# Altium schematic sheet machdien.SchDoc
size A0 portrait; SheetNumber: 1; SheetTotal: 1
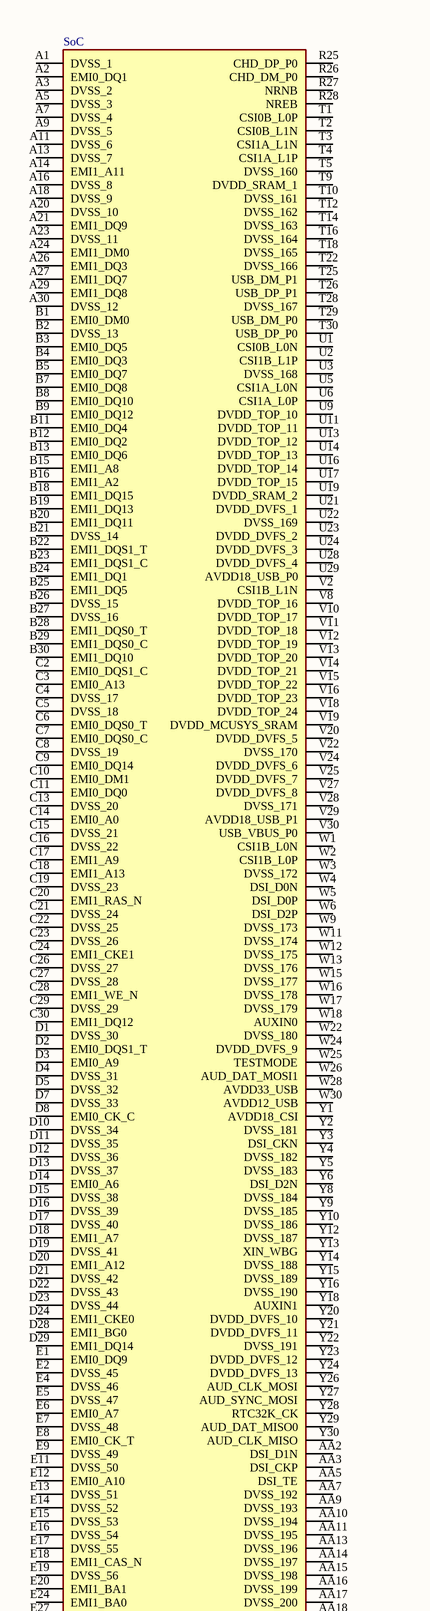
[diagram p0: machdien.SchDoc, top left]
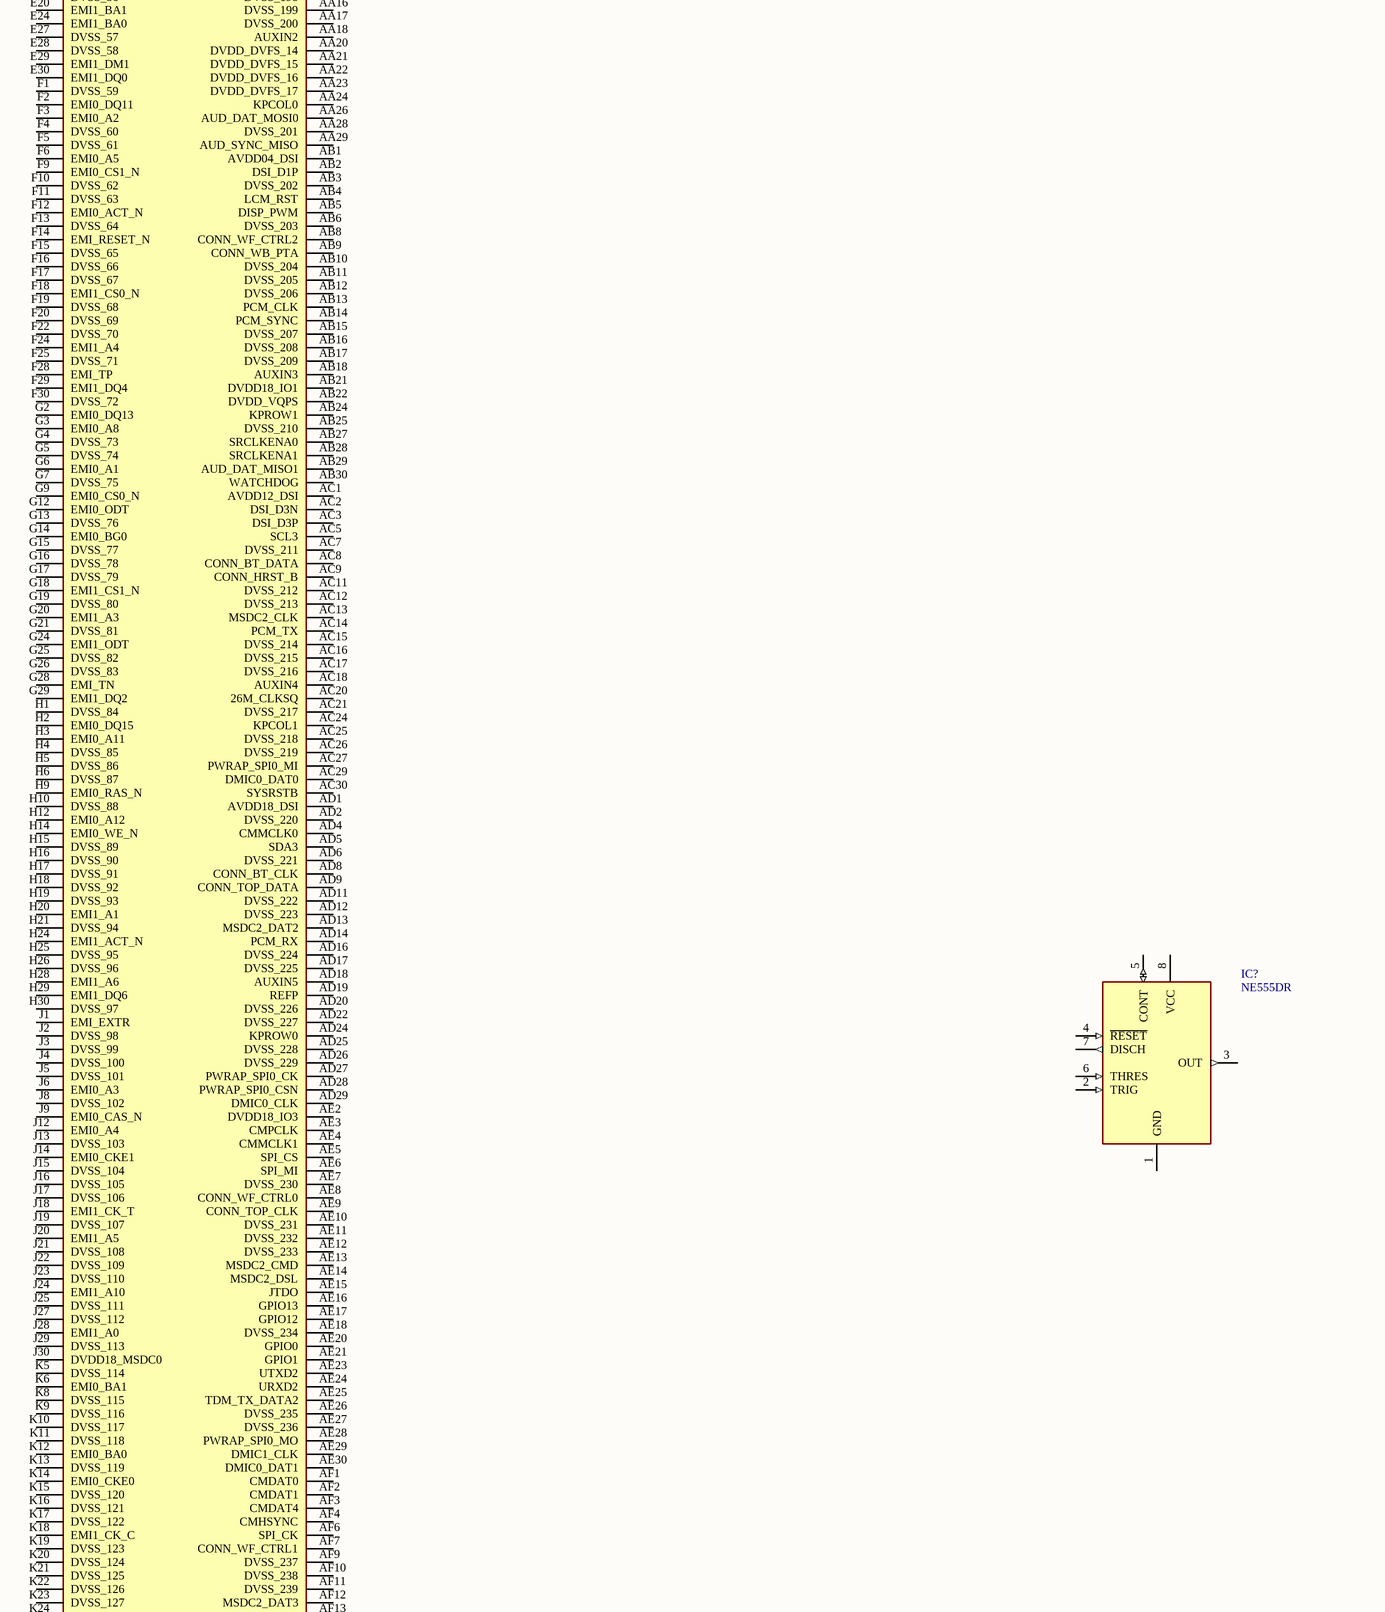
[diagram p1: machdien.SchDoc, centre left]
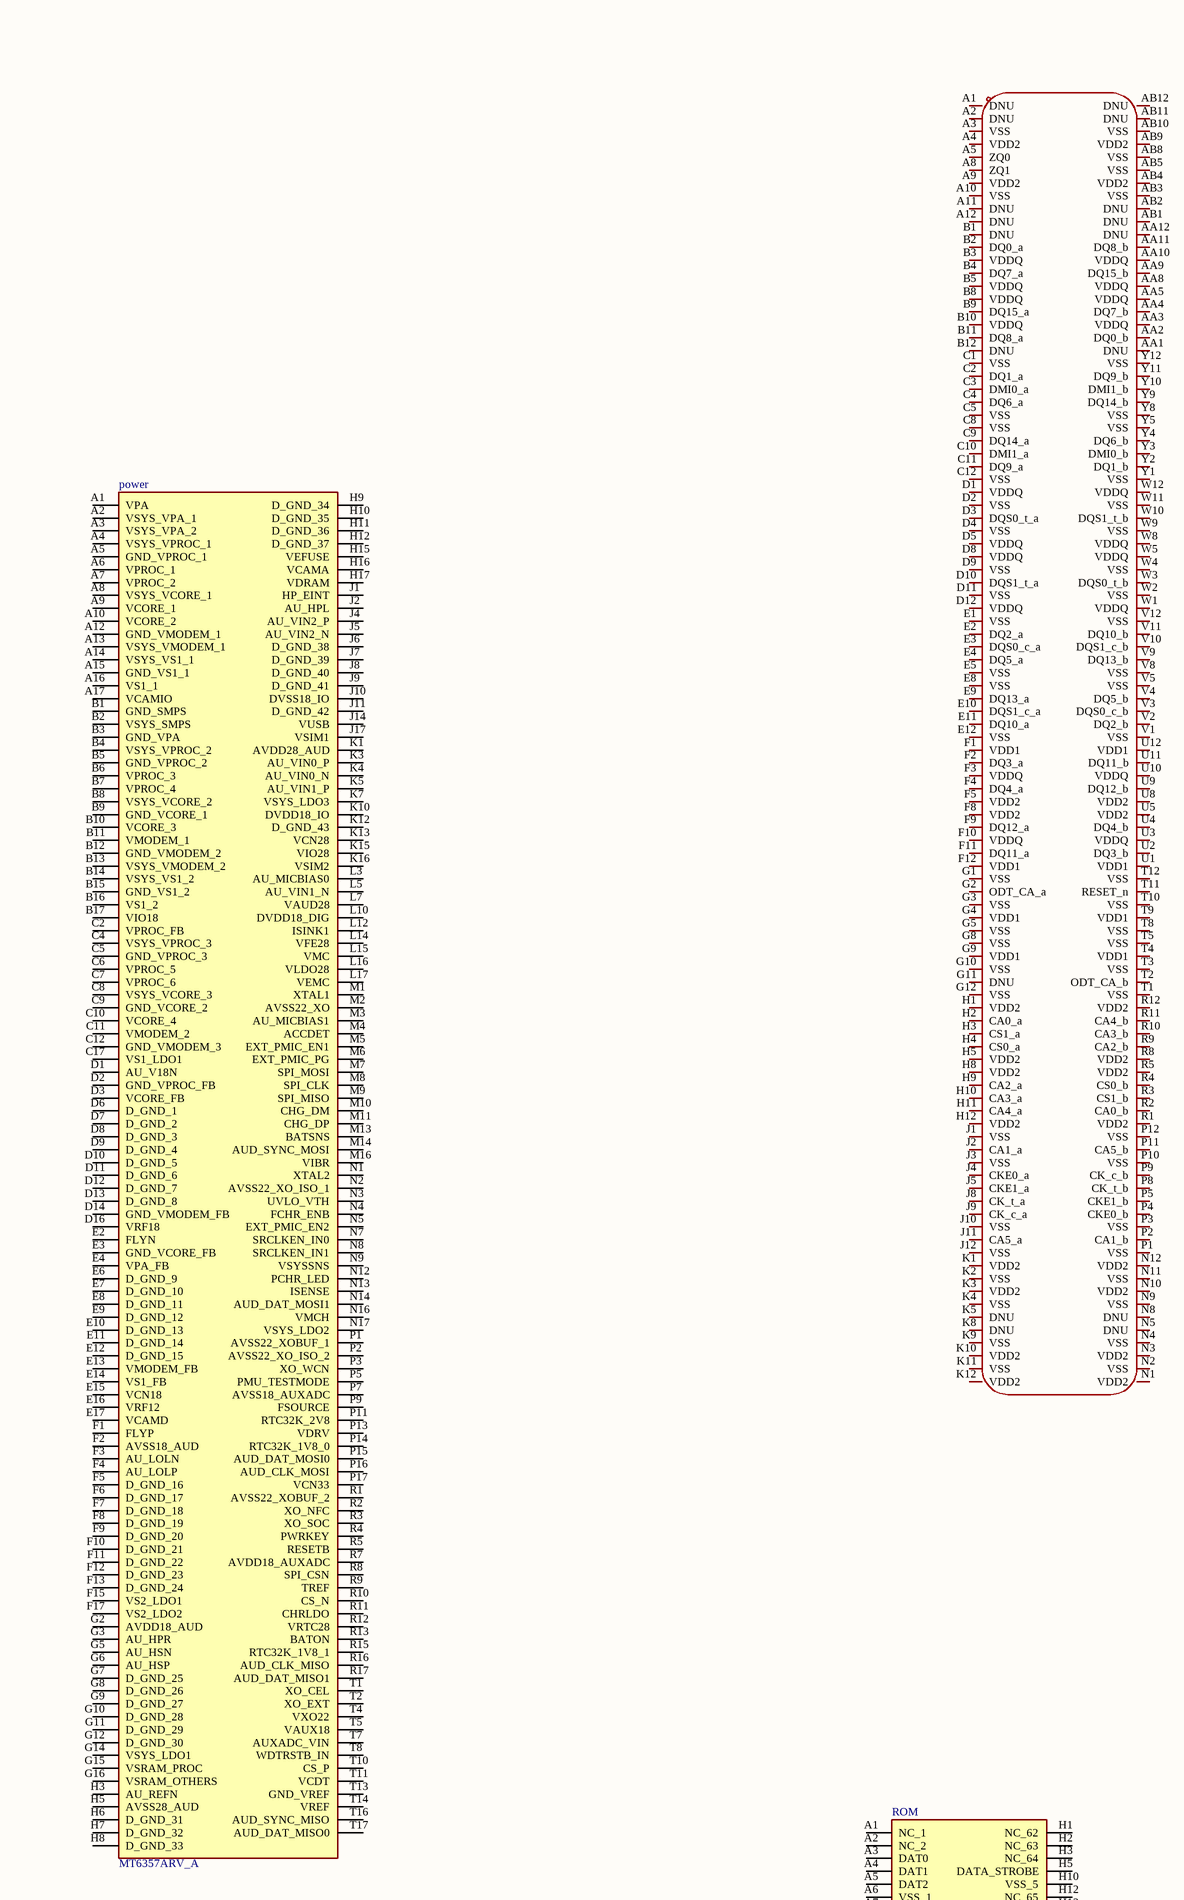
[diagram p2: machdien.SchDoc, centre right]
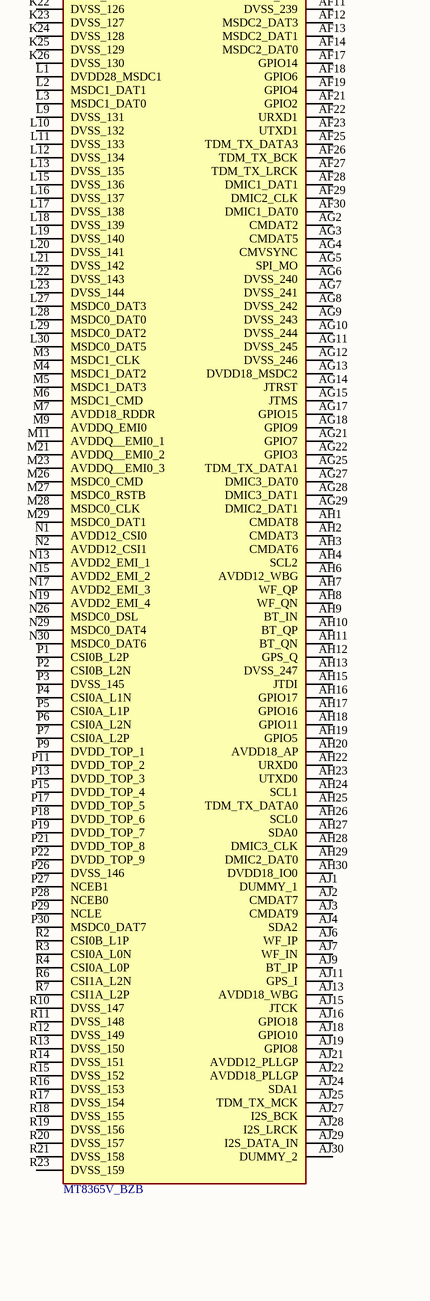
[diagram p3: machdien.SchDoc, bottom left]
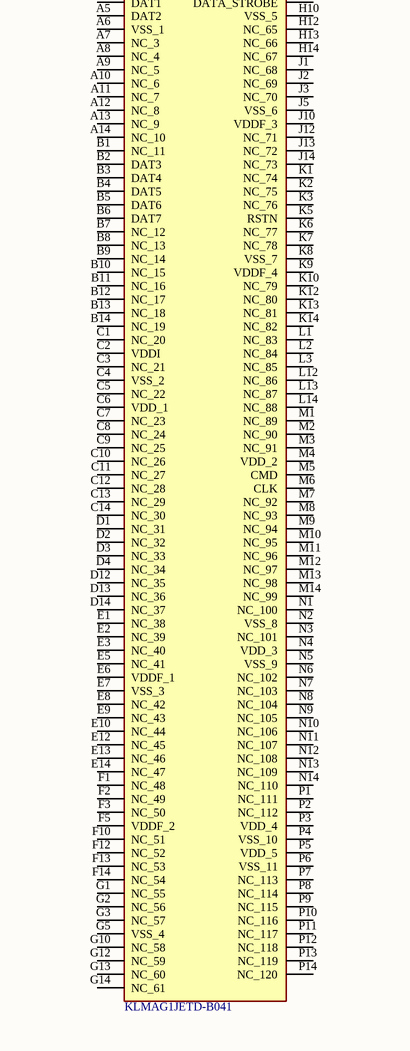
[diagram p4: machdien.SchDoc, bottom right]

## Parts
IC?  NE555DR  [SOIC127P600X175-8N]
power  MT6357ARV_A  [BGA209C40P17X16_700X660X100]
RAM  K4UBE3D4AA-MGCL  [K4F8E304HB-MGCJ]  (value not drawn)
ROM  KLMAG1JETD-B041  [BGA153C50P14X14_1150X1300X80]
SoC  MT8365V_BZB  [BGA633C40P30X29_1220X1180X90]

## Nets

Not connected (* = marked no-connect by the designer): IC? 1(GND) 2(TRIG) 3(OUT) 4(~{RESET}) 5(CONT) 6(THRES) 7(DISCH) 8(VCC); power A1(VPA) A2(VSYS_VPA_1) A3(VSYS_VPA_2) A4(VSYS_VPROC_1) A5(GND_VPROC_1) A6(VPROC_1) A7(VPROC_2) A8(VSYS_VCORE_1) A9(VCORE_1) A10(VCORE_2) A12(GND_VMODEM_1) A13(VSYS_VMODEM_1) A14(VSYS_VS1_1) A15(GND_VS1_1) A16(VS1_1) A17(VCAMIO) B1(GND_SMPS) B2(VSYS_SMPS) B3(GND_VPA) B4(VSYS_VPROC_2) B5(GND_VPROC_2) B6(VPROC_3) B7(VPROC_4) B8(VSYS_VCORE_2) B9(GND_VCORE_1) B10(VCORE_3) B11(VMODEM_1) B12(GND_VMODEM_2) B13(VSYS_VMODEM_2) B14(VSYS_VS1_2) B15(GND_VS1_2) B16(VS1_2) B17(VIO18) C2(VPROC_FB) C4(VSYS_VPROC_3) C5(GND_VPROC_3) C6(VPROC_5) C7(VPROC_6) C8(VSYS_VCORE_3) C9(GND_VCORE_2) C10(VCORE_4) C11(VMODEM_2) C12(GND_VMODEM_3) C17(VS1_LDO1) D1(AU_V18N) D2(GND_VPROC_FB) D3(VCORE_FB) D6(D_GND_1) D7(D_GND_2) D8(D_GND_3) D9(D_GND_4) D10(D_GND_5) D11(D_GND_6) D12(D_GND_7) D13(D_GND_8) D14(GND_VMODEM_FB) D16(VRF18) E2(FLYN) E3(GND_VCORE_FB) E4(VPA_FB) E6(D_GND_9) E7(D_GND_10) E8(D_GND_11) E9(D_GND_12) E10(D_GND_13) E11(D_GND_14) E12(D_GND_15) E13(VMODEM_FB) E14(VS1_FB) E15(VCN18) E16(VRF12) E17(VCAMD) F1(FLYP) F2(AVSS18_AUD) F3(AU_LOLN) F4(AU_LOLP) F5(D_GND_16) F6(D_GND_17) F7(D_GND_18) F8(D_GND_19) F9(D_GND_20) F10(D_GND_21) F11(D_GND_22) F12(D_GND_23) F13(D_GND_24) F15(VS2_LDO1) F17(VS2_LDO2) G2(AVDD18_AUD) G3(AU_HPR) G5(AU_HSN) G6(AU_HSP) G7(D_GND_25) G8(D_GND_26) G9(D_GND_27) G10(D_GND_28) G11(D_GND_29) G12(D_GND_30) G14(VSYS_LDO1) G15(VSRAM_PROC) G16(VSRAM_OTHERS) H3(AU_REFN) H5(AVSS28_AUD) H6(D_GND_31) H7(D_GND_32) H8(D_GND_33) H9(D_GND_34) H10(D_GND_35) H11(D_GND_36) H12(D_GND_37) H15(VEFUSE) H16(VCAMA) H17(VDRAM) J1(HP_EINT) J2(AU_HPL) J4(AU_VIN2_P) J5(AU_VIN2_N) J6(D_GND_38) J7(D_GND_39) J8(D_GND_40) J9(D_GND_41) J10(DVSS18_IO) J11(D_GND_42) J14(VUSB) J17(VSIM1) K1(AVDD28_AUD) K3(AU_VIN0_P) K4(AU_VIN0_N) K5(AU_VIN1_P) K7(VSYS_LDO3) K10(DVDD18_IO) K12(D_GND_43) K13(VCN28) K15(VIO28) K16(VSIM2) L3(AU_MICBIAS0) L5(AU_VIN1_N) L7(VAUD28) L10(DVDD18_DIG) L12(ISINK1) L14(VFE28) L15(VMC) L16(VLDO28) L17(VEMC) M1(XTAL1) M2(AVSS22_XO) M3(AU_MICBIAS1) M4(ACCDET) M5(EXT_PMIC_EN1) M6(EXT_PMIC_PG) M7(SPI_MOSI) M8(SPI_CLK) M9(SPI_MISO) M10(CHG_DM) M11(CHG_DP) M13(BATSNS) M14(AUD_SYNC_MOSI) M16(VIBR) N1(XTAL2) N2(AVSS22_XO_ISO_1) N3(UVLO_VTH) N4(FCHR_ENB) N5(EXT_PMIC_EN2) N7(SRCLKEN_IN0) N8(SRCLKEN_IN1) N9(VSYSSNS) N12(PCHR_LED) N13(ISENSE) N14(AUD_DAT_MOSI1) N16(VMCH) N17(VSYS_LDO2) P1(AVSS22_XOBUF_1) P2(AVSS22_XO_ISO_2) P3(XO_WCN) P5(PMU_TESTMODE) P7(AVSS18_AUXADC) P9(FSOURCE) P11(RTC32K_2V8) P13(VDRV) P14(RTC32K_1V8_0) P15(AUD_DAT_MOSI0) P16(AUD_CLK_MOSI) P17(VCN33) R1(AVSS22_XOBUF_2) R2(XO_NFC) R3(XO_SOC) R4(PWRKEY) R5(RESETB) R7(AVDD18_AUXADC) R8(SPI_CSN) R9(TREF) R10(CS_N) R11(CHRLDO) R12(VRTC28) R13(BATON) R15(RTC32K_1V8_1) R16(AUD_CLK_MISO) R17(AUD_DAT_MISO1) T1(XO_CEL) T2(XO_EXT) T4(VXO22) T5(VAUX18) T7(AUXADC_VIN) T8(WDTRSTB_IN) T10(CS_P) T11(VCDT) T13(GND_VREF) T14(VREF) T16(AUD_SYNC_MISO) T17(AUD_DAT_MISO0); RAM A1(DNU) A2(DNU) A3(VSS) A4(VDD2) A5(ZQ0) A8(ZQ1) A9(VDD2) A10(VSS) A11(DNU) A12(DNU) AA1(DNU) AA2(DQ0_b) AA3(VDDQ) AA4(DQ7_b) AA5(VDDQ) AA8(VDDQ) AA9(DQ15_b) AA10(VDDQ) AA11(DQ8_b) AA12(DNU) AB1(DNU) AB2(DNU) AB3(VSS) AB4(VDD2) AB5(VSS) AB8(VSS) AB9(VDD2) AB10(VSS) AB11(DNU) AB12(DNU) B1(DNU) B2(DQ0_a) B3(VDDQ) B4(DQ7_a) B5(VDDQ) B8(VDDQ) B9(DQ15_a) B10(VDDQ) B11(DQ8_a) B12(DNU) C1(VSS) C2(DQ1_a) C3(DMI0_a) C4(DQ6_a) C5(VSS) C8(VSS) C9(DQ14_a) C10(DMI1_a) C11(DQ9_a) C12(VSS) D1(VDDQ) D2(VSS) D3(DQS0_t_a) D4(VSS) D5(VDDQ) D8(VDDQ) D9(VSS) D10(DQS1_t_a) D11(VSS) D12(VDDQ) E1(VSS) E2(DQ2_a) E3(DQS0_c_a) E4(DQ5_a) E5(VSS) E8(VSS) E9(DQ13_a) E10(DQS1_c_a) E11(DQ10_a) E12(VSS) F1(VDD1) F2(DQ3_a) F3(VDDQ) F4(DQ4_a) F5(VDD2) F8(VDD2) F9(DQ12_a) F10(VDDQ) F11(DQ11_a) F12(VDD1) G1(VSS) G2(ODT_CA_a) G3(VSS) G4(VDD1) G5(VSS) G8(VSS) G9(VDD1) G10(VSS) G11(DNU) G12(VSS) H1(VDD2) H2(CA0_a) H3(CS1_a) H4(CS0_a) H5(VDD2) H8(VDD2) H9(CA2_a) H10(CA3_a) H11(CA4_a) H12(VDD2) J1(VSS) J2(CA1_a) J3(VSS) J4(CKE0_a) J5(CKE1_a) J8(CK_t_a) J9(CK_c_a) J10(VSS) J11(CA5_a) J12(VSS) K1(VDD2) K2(VSS) K3(VDD2) K4(VSS) K5(DNU) K8(DNU) K9(VSS) K10(VDD2) K11(VSS) K12(VDD2) N1(VDD2) N2(VSS) N3(VDD2) N4(VSS) N5(DNU) N8(DNU) N9(VSS) N10(VDD2) N11(VSS) N12(VDD2) P1(VSS) P2(CA1_b) P3(VSS) P4(CKE0_b) P5(CKE1_b) P8(CK_t_b) P9(CK_c_b) P10(VSS) P11(CA5_b) P12(VSS) R1(VDD2) R2(CA0_b) R3(CS1_b) R4(CS0_b) R5(VDD2) R8(VDD2) R9(CA2_b) R10(CA3_b) R11(CA4_b) R12(VDD2) T1(VSS) T2(ODT_CA_b) T3(VSS) T4(VDD1) T5(VSS) T8(VSS) T9(VDD1) T10(VSS) T11(RESET_n) T12(VSS) U1(VDD1) U2(DQ3_b) U3(VDDQ) U4(DQ4_b) U5(VDD2) U8(VDD2) U9(DQ12_b) U10(VDDQ) U11(DQ11_b) U12(VDD1) V1(VSS) V2(DQ2_b) V3(DQS0_c_b) V4(DQ5_b) V5(VSS) V8(VSS) V9(DQ13_b) V10(DQS1_c_b) V11(DQ10_b) V12(VSS) W1(VDDQ) W2(VSS) W3(DQS0_t_b) W4(VSS) W5(VDDQ) W8(VDDQ) W9(VSS) W10(DQS1_t_b) W11(VSS) W12(VDDQ) Y1(VSS) Y2(DQ1_b) Y3(DMI0_b) Y4(DQ6_b) Y5(VSS) Y8(VSS) Y9(DQ14_b) Y10(DMI1_b) Y11(DQ9_b) Y12(VSS); ROM A1(NC_1) A2(NC_2) A3(DAT0) A4(DAT1) A5(DAT2) A6(VSS_1) A7(NC_3) A8(NC_4) A9(NC_5) A10(NC_6) A11(NC_7) A12(NC_8) A13(NC_9) A14(NC_10) B1(NC_11) B2(DAT3) B3(DAT4) B4(DAT5) B5(DAT6) B6(DAT7) B7(NC_12) B8(NC_13) B9(NC_14) B10(NC_15) B11(NC_16) B12(NC_17) B13(NC_18) B14(NC_19) C1(NC_20) C2(VDDI) C3(NC_21) C4(VSS_2) C5(NC_22) C6(VDD_1) C7(NC_23) C8(NC_24) C9(NC_25) C10(NC_26) C11(NC_27) C12(NC_28) C13(NC_29) C14(NC_30) D1(NC_31) D2(NC_32) D3(NC_33) D4(NC_34) D12(NC_35) D13(NC_36) D14(NC_37) E1(NC_38) E2(NC_39) E3(NC_40) E5(NC_41) E6(VDDF_1) E7(VSS_3) E8(NC_42) E9(NC_43) E10(NC_44) E12(NC_45) E13(NC_46) E14(NC_47) F1(NC_48) F2(NC_49) F3(NC_50) F5(VDDF_2) F10(NC_51) F12(NC_52) F13(NC_53) F14(NC_54) G1(NC_55) G2(NC_56) G3(NC_57) G5(VSS_4) G10(NC_58) G12(NC_59) G13(NC_60) G14(NC_61) H1(NC_62) H2(NC_63) H3(NC_64) H5(DATA_STROBE) H10(VSS_5) H12(NC_65) H13(NC_66) H14(NC_67) J1(NC_68) J2(NC_69) J3(NC_70) J5(VSS_6) J10(VDDF_3) J12(NC_71) J13(NC_72) J14(NC_73) K1(NC_74) K2(NC_75) K3(NC_76) K5(RSTN) K6(NC_77) K7(NC_78) K8(VSS_7) K9(VDDF_4) K10(NC_79) K12(NC_80) K13(NC_81) K14(NC_82) L1(NC_83) L2(NC_84) L3(NC_85) L12(NC_86) L13(NC_87) L14(NC_88) M1(NC_89) M2(NC_90) M3(NC_91) M4(VDD_2) M5(CMD) M6(CLK) M7(NC_92) M8(NC_93) M9(NC_94) M10(NC_95) M11(NC_96) M12(NC_97) M13(NC_98) M14(NC_99) N1(NC_100) N2(VSS_8) N3(NC_101) N4(VDD_3) N5(VSS_9) N6(NC_102) N7(NC_103) N8(NC_104) N9(NC_105) N10(NC_106) N11(NC_107) N12(NC_108) N13(NC_109) N14(NC_110) P1(NC_111) P2(NC_112) P3(VDD_4) P4(VSS_10) P5(VDD_5) P6(VSS_11) P7(NC_113) P8(NC_114) P9(NC_115) P10(NC_116) P11(NC_117) P12(NC_118) P13(NC_119) P14(NC_120); SoC A1(DVSS_1) A2(EMI0_DQ1) A3(DVSS_2) A5(DVSS_3) A7(DVSS_4) A9(DVSS_5) A11(DVSS_6) A13(DVSS_7) A14(EMI1_A11) A16(DVSS_8) A18(DVSS_9) A20(DVSS_10) A21(EMI1_DQ9) A23(DVSS_11) A24(EMI1_DM0) A26(EMI1_DQ3) A27(EMI1_DQ7) A29(EMI1_DQ8) A30(DVSS_12) AA2(DSI_D1N) AA3(DSI_CKP) AA5(DSI_TE) AA7(DVSS_192) AA9(DVSS_193) AA10(DVSS_194) AA11(DVSS_195) AA13(DVSS_196) AA14(DVSS_197) AA15(DVSS_198) AA16(DVSS_199) AA17(DVSS_200) AA18(AUXIN2) AA20(DVDD_DVFS_14) AA21(DVDD_DVFS_15) AA22(DVDD_DVFS_16) AA23(DVDD_DVFS_17) AA24(KPCOL0) AA26(AUD_DAT_MOSI0) AA28(DVSS_201) AA29(AUD_SYNC_MISO) AB1(AVDD04_DSI) AB2(DSI_D1P) AB3(DVSS_202) AB4(LCM_RST) AB5(DISP_PWM) AB6(DVSS_203) AB8(CONN_WF_CTRL2) AB9(CONN_WB_PTA) AB10(DVSS_204) AB11(DVSS_205) AB12(DVSS_206) AB13(PCM_CLK) AB14(PCM_SYNC) AB15(DVSS_207) AB16(DVSS_208) AB17(DVSS_209) AB18(AUXIN3) AB21(DVDD18_IO1) AB22(DVDD_VQPS) AB24(KPROW1) AB25(DVSS_210) AB27(SRCLKENA0) AB28(SRCLKENA1) AB29(AUD_DAT_MISO1) AB30(WATCHDOG) AC1(AVDD12_DSI) AC2(DSI_D3N) AC3(DSI_D3P) AC5(SCL3) AC7(DVSS_211) AC8(CONN_BT_DATA) AC9(CONN_HRST_B) AC11(DVSS_212) AC12(DVSS_213) AC13(MSDC2_CLK) AC14(PCM_TX) AC15(DVSS_214) AC16(DVSS_215) AC17(DVSS_216) AC18(AUXIN4) AC20(26M_CLKSQ) AC21(DVSS_217) AC24(KPCOL1) AC25(DVSS_218) AC26(DVSS_219) AC27(PWRAP_SPI0_MI) AC29(DMIC0_DAT0) AC30(SYSRSTB) AD1(AVDD18_DSI) AD2(DVSS_220) AD4(CMMCLK0) AD5(SDA3) AD6(DVSS_221) AD8(CONN_BT_CLK) AD9(CONN_TOP_DATA) AD11(DVSS_222) AD12(DVSS_223) AD13(MSDC2_DAT2) AD14(PCM_RX) AD16(DVSS_224) AD17(DVSS_225) AD18(AUXIN5) AD19(REFP) AD20(DVSS_226) AD22(DVSS_227) AD24(KPROW0) AD25(DVSS_228) AD26(DVSS_229) AD27(PWRAP_SPI0_CK) AD28(PWRAP_SPI0_CSN) AD29(DMIC0_CLK) AE2(DVDD18_IO3) AE3(CMPCLK) AE4(CMMCLK1) AE5(SPI_CS) AE6(SPI_MI) AE7(DVSS_230) AE8(CONN_WF_CTRL0) AE9(CONN_TOP_CLK) AE10(DVSS_231) AE11(DVSS_232) AE12(DVSS_233) AE13(MSDC2_CMD) AE14(MSDC2_DSL) AE15(JTDO) AE16(GPIO13) AE17(GPIO12) AE18(DVSS_234) AE20(GPIO0) AE21(GPIO1) AE23(UTXD2) AE24(URXD2) AE25(TDM_TX_DATA2) AE26(DVSS_235) AE27(DVSS_236) AE28(PWRAP_SPI0_MO) AE29(DMIC1_CLK) AE30(DMIC0_DAT1) AF1(CMDAT0) AF2(CMDAT1) AF3(CMDAT4) AF4(CMHSYNC) AF6(SPI_CK) AF7(CONN_WF_CTRL1) AF9(DVSS_237) AF10(DVSS_238) AF11(DVSS_239) AF12(MSDC2_DAT3) AF13(MSDC2_DAT1) AF14(MSDC2_DAT0) AF17(GPIO14) AF18(GPIO6) AF19(GPIO4) AF21(GPIO2) AF22(URXD1) AF23(UTXD1) AF25(TDM_TX_DATA3) AF26(TDM_TX_BCK) AF27(TDM_TX_LRCK) AF28(DMIC1_DAT1) AF29(DMIC2_CLK) AF30(DMIC1_DAT0) AG2(CMDAT2) AG3(CMDAT5) AG4(CMVSYNC) AG5(SPI_MO) AG6(DVSS_240) AG7(DVSS_241) AG8(DVSS_242) AG9(DVSS_243) AG10(DVSS_244) AG11(DVSS_245) AG12(DVSS_246) AG13(DVDD18_MSDC2) AG14(JTRST) AG15(JTMS) AG17(GPIO15) AG18(GPIO9) AG21(GPIO7) AG22(GPIO3) AG25(TDM_TX_DATA1) AG27(DMIC3_DAT0) AG28(DMIC3_DAT1) AG29(DMIC2_DAT1) AH1(CMDAT8) AH2(CMDAT3) AH3(CMDAT6) AH4(SCL2) AH6(AVDD12_WBG) AH7(WF_QP) AH8(WF_QN) AH9(BT_IN) AH10(BT_QP) AH11(BT_QN) AH12(GPS_Q) AH13(DVSS_247) AH15(JTDI) AH16(GPIO17) AH17(GPIO16) AH18(GPIO11) AH19(GPIO5) AH20(AVDD18_AP) AH22(URXD0) AH23(UTXD0) AH24(SCL1) AH25(TDM_TX_DATA0) AH26(SCL0) AH27(SDA0) AH28(DMIC3_CLK) AH29(DMIC2_DAT0) AH30(DVDD18_IO0) AJ1(DUMMY_1) AJ2(CMDAT7) AJ3(CMDAT9) AJ4(SDA2) AJ6(WF_IP) AJ7(WF_IN) AJ9(BT_IP) AJ11(GPS_I) AJ13(AVDD18_WBG) AJ15(JTCK) AJ16(GPIO18) AJ18(GPIO10) AJ19(GPIO8) AJ21(AVDD12_PLLGP) AJ22(AVDD18_PLLGP) AJ24(SDA1) AJ25(TDM_TX_MCK) AJ27(I2S_BCK) AJ28(I2S_LRCK) AJ29(I2S_DATA_IN) AJ30(DUMMY_2) B1(EMI0_DM0) B2(DVSS_13) B3(EMI0_DQ5) B4(EMI0_DQ3) B5(EMI0_DQ7) B7(EMI0_DQ8) B8(EMI0_DQ10) B9(EMI0_DQ12) B11(EMI0_DQ4) B12(EMI0_DQ2) B13(EMI0_DQ6) B15(EMI1_A8) B16(EMI1_A2) B18(EMI1_DQ15) B19(EMI1_DQ13) B20(EMI1_DQ11) B21(DVSS_14) B22(EMI1_DQS1_T) B23(EMI1_DQS1_C) B24(EMI1_DQ1) B25(EMI1_DQ5) B26(DVSS_15) B27(DVSS_16) B28(EMI1_DQS0_T) B29(EMI1_DQS0_C) B30(EMI1_DQ10) C2(EMI0_DQS1_C) C3(EMI0_A13) C4(DVSS_17) C5(DVSS_18) C6(EMI0_DQS0_T) C7(EMI0_DQS0_C) C8(DVSS_19) C9(EMI0_DQ14) C10(EMI0_DM1) C11(EMI0_DQ0) C13(DVSS_20) C14(EMI0_A0) C15(DVSS_21) C16(DVSS_22) C17(EMI1_A9) C18(EMI1_A13) C19(DVSS_23) C20(EMI1_RAS_N) C21(DVSS_24) C22(DVSS_25) C23(DVSS_26) C24(EMI1_CKE1) C26(DVSS_27) C27(DVSS_28) C28(EMI1_WE_N) C29(DVSS_29) C30(EMI1_DQ12) D1(DVSS_30) D2(EMI0_DQS1_T) D3(EMI0_A9) D4(DVSS_31) D5(DVSS_32) D7(DVSS_33) D8(EMI0_CK_C) D10(DVSS_34) D11(DVSS_35) D12(DVSS_36) D13(DVSS_37) D14(EMI0_A6) D15(DVSS_38) D16(DVSS_39) D17(DVSS_40) D18(EMI1_A7) D19(DVSS_41) D20(EMI1_A12) D21(DVSS_42) D22(DVSS_43) D23(DVSS_44) D24(EMI1_CKE0) D28(EMI1_BG0) D29(EMI1_DQ14) E1(EMI0_DQ9) E2(DVSS_45) E4(DVSS_46) E5(DVSS_47) E6(EMI0_A7) E7(DVSS_48) E8(EMI0_CK_T) E9(DVSS_49) E11(DVSS_50) E12(EMI0_A10) E13(DVSS_51) E14(DVSS_52) E15(DVSS_53) E16(DVSS_54) E17(DVSS_55) E18(EMI1_CAS_N) E19(DVSS_56) E20(EMI1_BA1) E24(EMI1_BA0) E27(DVSS_57) E28(DVSS_58) E29(EMI1_DM1) E30(EMI1_DQ0) F1(DVSS_59) F2(EMI0_DQ11) F3(EMI0_A2) F4(DVSS_60) F5(DVSS_61) F6(EMI0_A5) F9(EMI0_CS1_N) F10(DVSS_62) F11(DVSS_63) F12(EMI0_ACT_N) F13(DVSS_64) F14(EMI_RESET_N) F15(DVSS_65) F16(DVSS_66) F17(DVSS_67) F18(EMI1_CS0_N) F19(DVSS_68) F20(DVSS_69) F22(DVSS_70) F24(EMI1_A4) F25(DVSS_71) F28(EMI_TP) F29(EMI1_DQ4) F30(DVSS_72) G2(EMI0_DQ13) G3(EMI0_A8) G4(DVSS_73) G5(DVSS_74) G6(EMI0_A1) G7(DVSS_75) G9(EMI0_CS0_N) G12(EMI0_ODT) G13(DVSS_76) G14(EMI0_BG0) G15(DVSS_77) G16(DVSS_78) G17(DVSS_79) G18(EMI1_CS1_N) G19(DVSS_80) G20(EMI1_A3) G21(DVSS_81) G24(EMI1_ODT) G25(DVSS_82) G26(DVSS_83) G28(EMI_TN) G29(EMI1_DQ2) H1(DVSS_84) H2(EMI0_DQ15) H3(EMI0_A11) H4(DVSS_85) H5(DVSS_86) H6(DVSS_87) H9(EMI0_RAS_N) H10(DVSS_88) H12(EMI0_A12) H14(EMI0_WE_N) H15(DVSS_89) H16(DVSS_90) H17(DVSS_91) H18(DVSS_92) H19(DVSS_93) H20(EMI1_A1) H21(DVSS_94) H24(EMI1_ACT_N) H25(DVSS_95) H26(DVSS_96) H28(EMI1_A6) H29(EMI1_DQ6) H30(DVSS_97) J1(EMI_EXTR) J2(DVSS_98) J3(DVSS_99) J4(DVSS_100) J5(DVSS_101) J6(EMI0_A3) J8(DVSS_102) J9(EMI0_CAS_N) J12(EMI0_A4) J13(DVSS_103) J14(EMI0_CKE1) J15(DVSS_104) J16(DVSS_105) J17(DVSS_106) J18(EMI1_CK_T) J19(DVSS_107) J20(EMI1_A5) J21(DVSS_108) J22(DVSS_109) J23(DVSS_110) J24(EMI1_A10) J25(DVSS_111) J27(DVSS_112) J28(EMI1_A0) J29(DVSS_113) J30(DVDD18_MSDC0) K5(DVSS_114) K6(EMI0_BA1) K8(DVSS_115) K9(DVSS_116) K10(DVSS_117) K11(DVSS_118) K12(EMI0_BA0) K13(DVSS_119) K14(EMI0_CKE0) K15(DVSS_120) K16(DVSS_121) K17(DVSS_122) K18(EMI1_CK_C) K19(DVSS_123) K20(DVSS_124) K21(DVSS_125) K22(DVSS_126) K23(DVSS_127) K24(DVSS_128) K25(DVSS_129) K26(DVSS_130) L1(DVDD28_MSDC1) L2(MSDC1_DAT1) L3(MSDC1_DAT0) L9(DVSS_131) L10(DVSS_132) L11(DVSS_133) L12(DVSS_134) L13(DVSS_135) L15(DVSS_136) L16(DVSS_137) L17(DVSS_138) L18(DVSS_139) L19(DVSS_140) L20(DVSS_141) L21(DVSS_142) L22(DVSS_143) L23(DVSS_144) L27(MSDC0_DAT3) L28(MSDC0_DAT0) L29(MSDC0_DAT2) L30(MSDC0_DAT5) M3(MSDC1_CLK) M4(MSDC1_DAT2) M5(MSDC1_DAT3) M6(MSDC1_CMD) M7(AVDD18_RDDR) M9(AVDDQ_EMI0) M11(AVDDQ__EMI0_1) M21(AVDDQ__EMI0_2) M23(AVDDQ__EMI0_3) M26(MSDC0_CMD) M27(MSDC0_RSTB) M28(MSDC0_CLK) M29(MSDC0_DAT1) N1(AVDD12_CSI0) N2(AVDD12_CSI1) N13(AVDD2_EMI_1) N15(AVDD2_EMI_2) N17(AVDD2_EMI_3) N19(AVDD2_EMI_4) N26(MSDC0_DSL) N29(MSDC0_DAT4) N30(MSDC0_DAT6) P1(CSI0B_L2P) P2(CSI0B_L2N) P3(DVSS_145) P4(CSI0A_L1N) P5(CSI0A_L1P) P6(CSI0A_L2N) P7(CSI0A_L2P) P9(DVDD_TOP_1) P11(DVDD_TOP_2) P13(DVDD_TOP_3) P15(DVDD_TOP_4) P17(DVDD_TOP_5) P18(DVDD_TOP_6) P19(DVDD_TOP_7) P21(DVDD_TOP_8) P22(DVDD_TOP_9) P26(DVSS_146) P27(NCEB1) P28(NCEB0) P29(NCLE) P30(MSDC0_DAT7) R2(CSI0B_L1P) R3(CSI0A_L0N) R4(CSI0A_L0P) R6(CSI1A_L2N) R7(CSI1A_L2P) R10(DVSS_147) R11(DVSS_148) R12(DVSS_149) R13(DVSS_150) R14(DVSS_151) R15(DVSS_152) R16(DVSS_153) R17(DVSS_154) R18(DVSS_155) R19(DVSS_156) R20(DVSS_157) R21(DVSS_158) R23(DVSS_159) R25(CHD_DP_P0) R26(CHD_DM_P0) R27(NRNB) R28(NREB) T1(CSI0B_L0P) T2(CSI0B_L1N) T3(CSI1A_L1N) T4(CSI1A_L1P) T5(DVSS_160) T9(DVDD_SRAM_1) T10(DVSS_161) T12(DVSS_162) T14(DVSS_163) T16(DVSS_164) T18(DVSS_165) T22(DVSS_166) T25(USB_DM_P1) T26(USB_DP_P1) T28(DVSS_167) T29(USB_DM_P0) T30(USB_DP_P0) U1(CSI0B_L0N) U2(CSI1B_L1P) U3(DVSS_168) U5(CSI1A_L0N) U6(CSI1A_L0P) U9(DVDD_TOP_10) U11(DVDD_TOP_11) U13(DVDD_TOP_12) U14(DVDD_TOP_13) U16(DVDD_TOP_14) U17(DVDD_TOP_15) U19(DVDD_SRAM_2) U21(DVDD_DVFS_1) U22(DVSS_169) U23(DVDD_DVFS_2) U24(DVDD_DVFS_3) U28(DVDD_DVFS_4) U29(AVDD18_USB_P0) V2(CSI1B_L1N) V8(DVDD_TOP_16) V10(DVDD_TOP_17) V11(DVDD_TOP_18) V12(DVDD_TOP_19) V13(DVDD_TOP_20) V14(DVDD_TOP_21) V15(DVDD_TOP_22) V16(DVDD_TOP_23) V18(DVDD_TOP_24) V19(DVDD_MCUSYS_SRAM) V20(DVDD_DVFS_5) V22(DVSS_170) V24(DVDD_DVFS_6) V25(DVDD_DVFS_7) V27(DVDD_DVFS_8) V28(DVSS_171) V29(AVDD18_USB_P1) V30(USB_VBUS_P0) W1(CSI1B_L0N) W2(CSI1B_L0P) W3(DVSS_172) W4(DSI_D0N) W5(DSI_D0P) W6(DSI_D2P) W9(DVSS_173) W11(DVSS_174) W12(DVSS_175) W13(DVSS_176) W15(DVSS_177) W16(DVSS_178) W17(DVSS_179) W18(AUXIN0) W22(DVSS_180) W24(DVDD_DVFS_9) W25(TESTMODE) W26(AUD_DAT_MOSI1) W28(AVDD33_USB) W30(AVDD12_USB) Y1(AVDD18_CSI) Y2(DVSS_181) Y3(DSI_CKN) Y4(DVSS_182) Y5(DVSS_183) Y6(DSI_D2N) Y8(DVSS_184) Y9(DVSS_185) Y10(DVSS_186) Y12(DVSS_187) Y13(XIN_WBG) Y14(DVSS_188) Y15(DVSS_189) Y16(DVSS_190) Y18(AUXIN1) Y20(DVDD_DVFS_10) Y21(DVDD_DVFS_11) Y22(DVSS_191) Y23(DVDD_DVFS_12) Y24(DVDD_DVFS_13) Y26(AUD_CLK_MOSI) Y27(AUD_SYNC_MOSI) Y28(RTC32K_CK) Y29(AUD_DAT_MISO0) Y30(AUD_CLK_MISO)

## Library data of the parts
IC? = NE555DR: Integrated Circuit; Manufacturer_Name: Texas Instruments; Datasheet Link: http://www.ti.com/lit/ds/symlink/ne555.pdf; Height: 1.75mm; Manufacturer_Part_Number: NE555DR; Mouser Part Number: 595-NE555DR; Mouser Price/Stock: https://www.mouser.com/Search/Refine.aspx?Keyword=595-NE555DR; RS Part Number: 1218414; RS Price/Stock: http://uk.rs-online.com/web/p/products/1218414
power = MT6357ARV_A: Integrated Circuit; Manufacturer_Name: Mediatek; Manufacturer_Part_Number: MT6357ARV/A; Datasheet Link: https://mediatek-marketing.files.svdcdn.com/production/documents/Genio-PMICs/MTK_MT6357_Product-Brief_v1.0.pdf?dm=1696608680; Height: 1mm; Mouser Part Number: 840-MT6357ARV/A; Mouser Price/Stock: https://www.mouser.co.uk/ProductDetail/MediaTek/MT6357ARV-A?qs=Jm2GQyTW%2Fbim3iWdQ0ZJPw%3D%3D
RAM = K4UBE3D4AA-MGCL: Manufacturer: SAMSUNG(三星半导体); Add into BOM: yes; Memory Format: SDRAM LPDDR4X; Clock Frequency (fc): 2133MHz; Memory Size: 32Gbit; Supply Voltage: 1.7V~1.95V; Symbol: K4UBE3D4AA-MGCL; Device: K4UBE3D4AA-MGCL; LCSC Part Name: K4UBE3D4AA-MGCL 停产; Supplier Part: C2920257; Manufacturer Part: K4UBE3D4AA-MGCL; Supplier Footprint: FBGA-200; JLCPCB Part Class: Extended Part; Datasheet: https://atta.szlcsc.com/upload/public/pdf/source/20231024/5530CB18C2033A14DEC9B3A35E728586.pdf; Supplier: LCSC; Convert to PCB: yes; Supply current: -; Refresh Current: -; Operating Temperature: -25℃~+85℃
ROM = KLMAG1JETD-B041: Integrated Circuit; Manufacturer_Name: SAMSUNG; Datasheet Link: https://datasheet.lcsc.com/lcsc/2007011825_Samsung-KLMAG1JETD-B041_C499919.pdf; Height: 0.8mm; Manufacturer_Part_Number: KLMAG1JETD-B041
SoC = MT8365V_BZB: Integrated Circuit; Manufacturer_Name: Mediatek; Manufacturer_Part_Number: MT8365V/BZB; Datasheet Link: https://www.mouser.co.uk/datasheet/2/1074/MT8365_AIoT_Application_Processor_Datasheet_v1_0_2-3106631.pdf; Height: 0.9mm; Mouser Part Number: 840-MT8365V/BZB; Mouser Price/Stock: https://www.mouser.co.uk/ProductDetail/MediaTek/MT8365V-BZB?qs=Jm2GQyTW%2FbjcedX9ugwNWQ%3D%3D